# Altium schematic sheet СОГЛАСОВАНИЕ.SchDoc
size A2; Organization: Altium Limited; Address1: L3, 12a Rodborough Rd; Address2: Frenchs Forest; Address3: NSW; Address4: Australia 2086
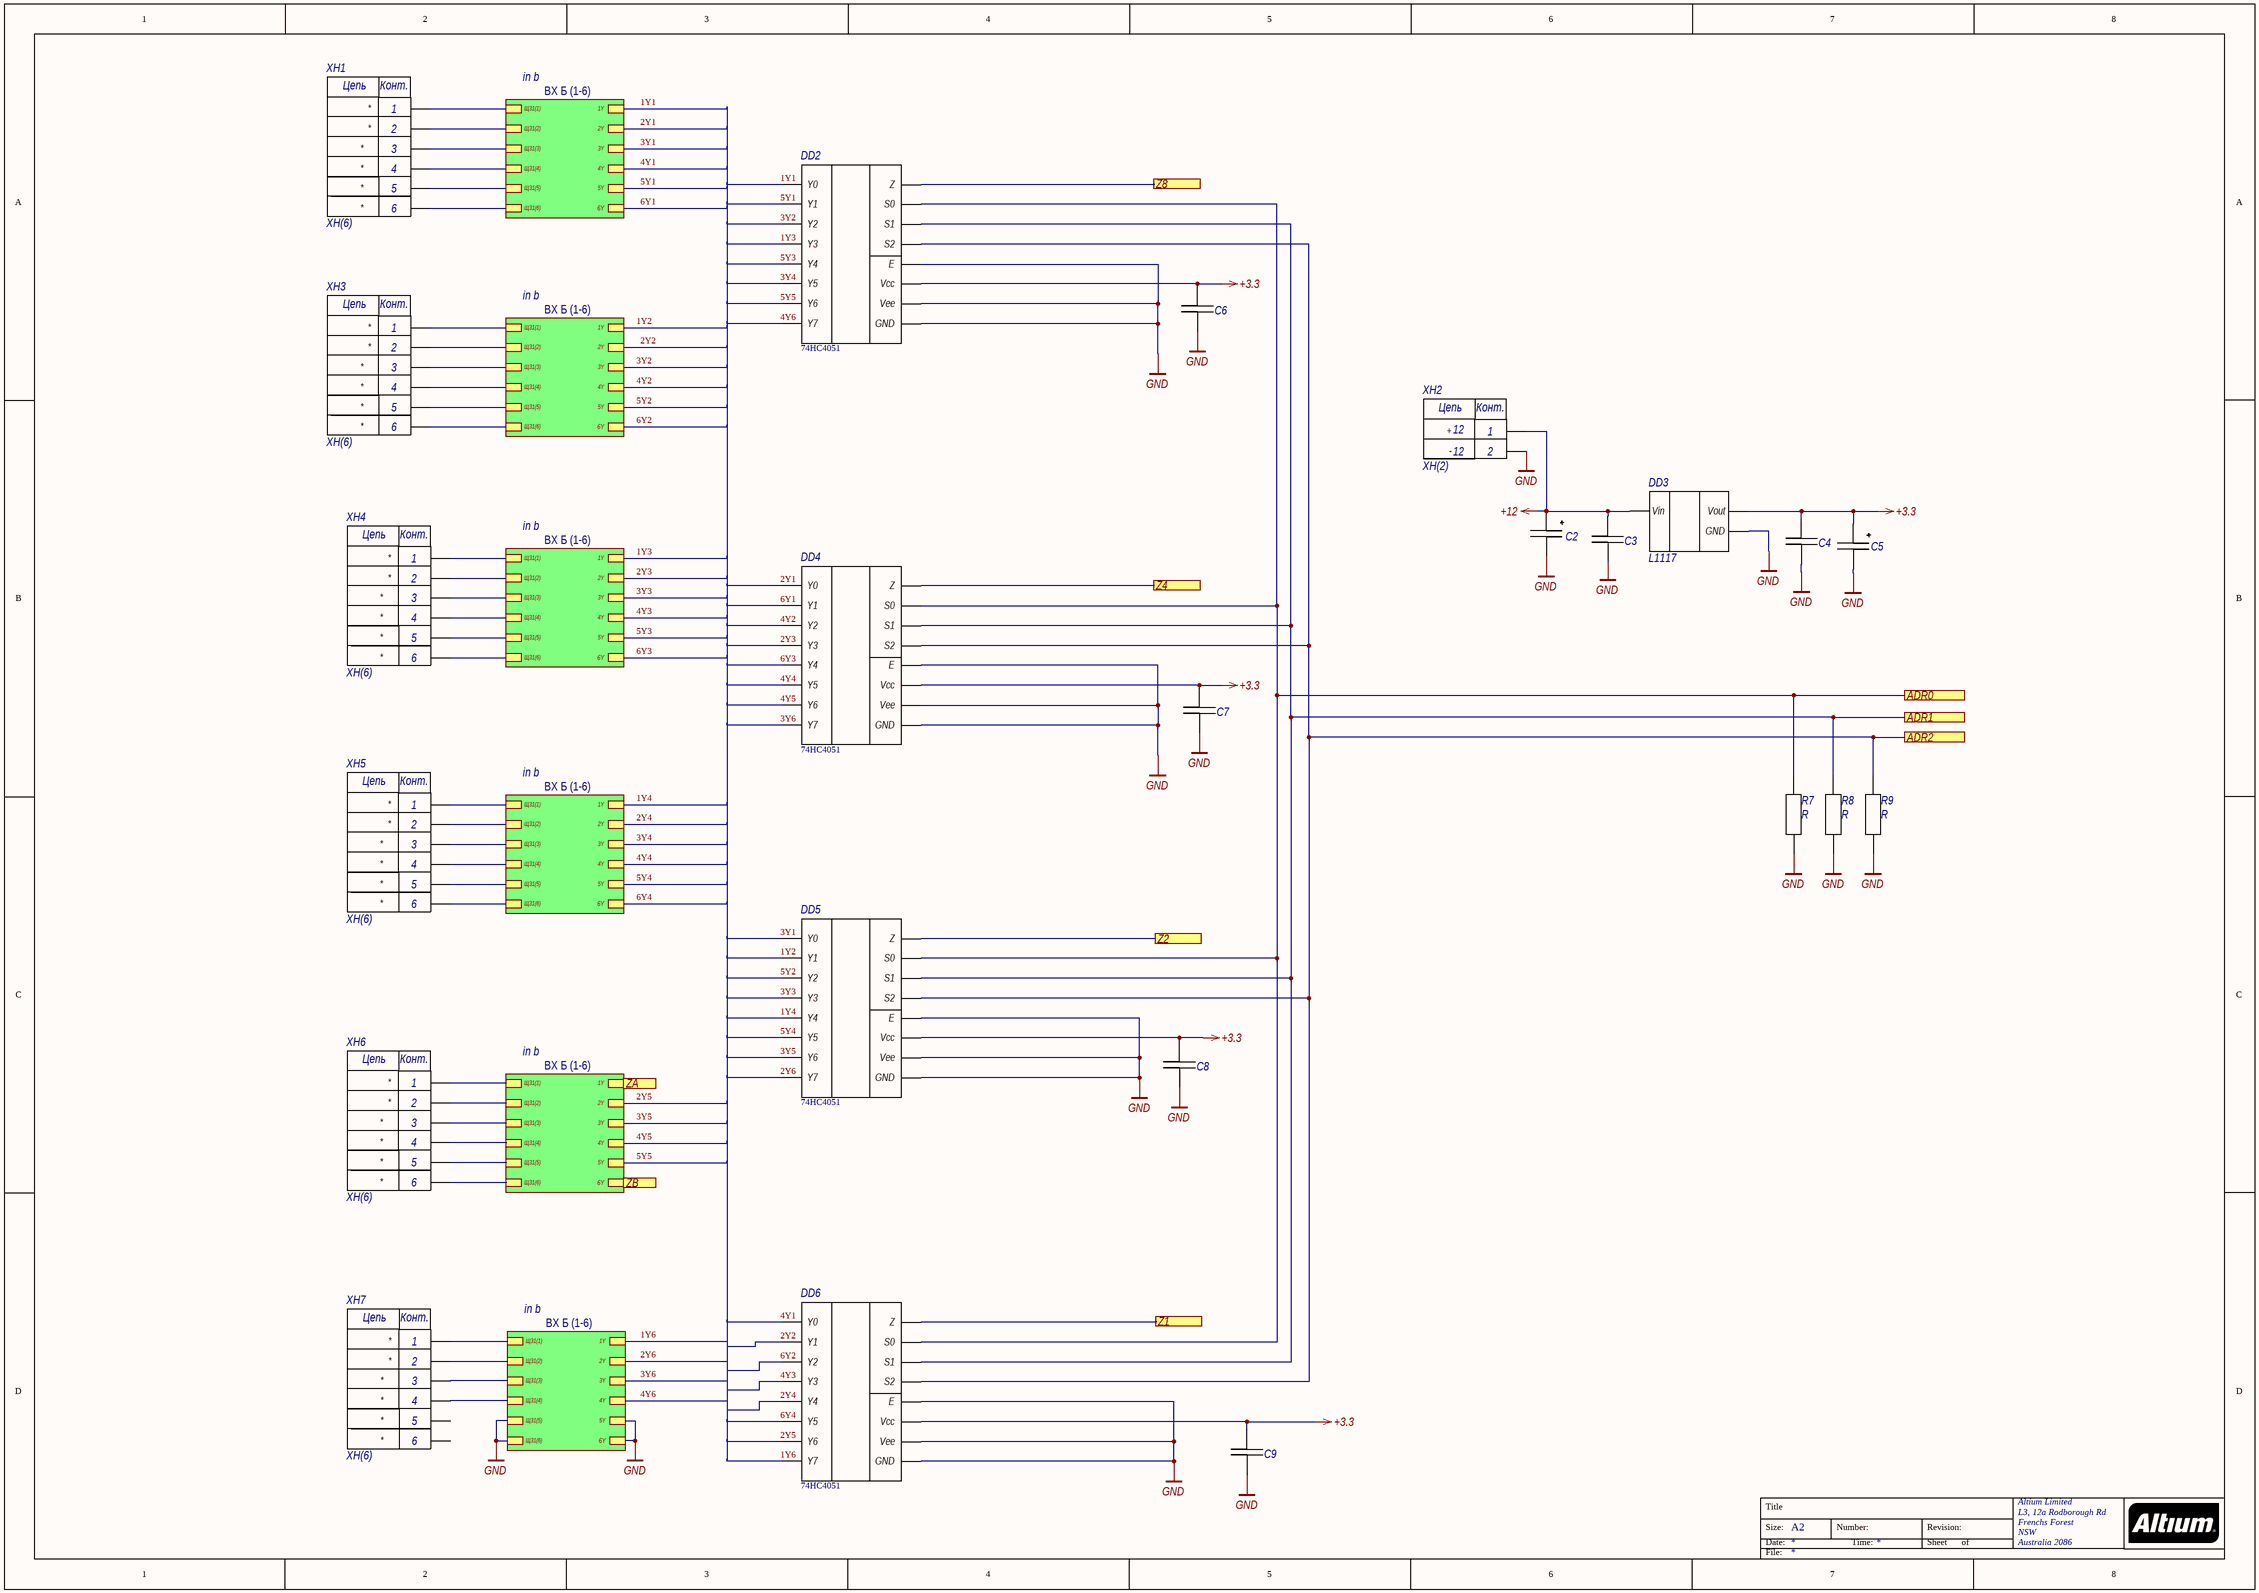
[diagram p0: СОГЛАСОВАНИЕ.SchDoc]

## Parts
C2  C(AlEL)  [C(AlEL)]  (value not drawn)
C3  C(ceramic)  [C(ceramic)]  (value not drawn)
C4  C(ceramic)  [C(ceramic)]  (value not drawn)
C5  C(AlEL)  [C(AlEL)]  (value not drawn)
C6  C(ceramic)  [C(ceramic)]  (value not drawn)
C7  C(ceramic)  [C(ceramic)]  (value not drawn)
C8  C(ceramic)  [C(ceramic)]  (value not drawn)
C9  C(ceramic)  [C(ceramic)]  (value not drawn)
DD2  74HC4051  [74HC4050(51)]
DD3  L1117  [LDL1117]
DD4  74HC4051  [74HC4050(51)]
DD5  74HC4051  [74HC4050(51)]
DD6  74HC4051  [74HC4050(51)]
R7  R  [R]
R8  R  [R]
R9  R  [R]
XH1  ХH(6)  [XH(6)]
XH2  ХН(2)  [ХН(2)]
XH3  ХH(6)  [XH(6)]
XH4  ХH(6)  [XH(6)]
XH5  ХH(6)  [XH(6)]
XH6  ХH(6)  [XH(6)]
XH7  ХH(6)  [XH(6)]

## Sub-sheets
in b = ВХ Б (1-6): 1Y, 2Y, 3Y, 4Y, Щ31(1), Щ31(2), Щ31(3), Щ31(4), 5Y, 6Y, Щ31(5), Щ31(6)
in b = ВХ Б (1-6): 1Y, 2Y, 3Y, 4Y, Щ31(1), Щ31(2), Щ31(3), Щ31(4), 5Y, 6Y, Щ31(5), Щ31(6)
in b = ВХ Б (1-6): 1Y, 2Y, 3Y, 4Y, Щ31(1), Щ31(2), Щ31(3), Щ31(4), 5Y, 6Y, Щ31(5), Щ31(6)
in b = ВХ Б (1-6): 1Y, 2Y, 3Y, 4Y, Щ31(1), Щ31(2), Щ31(3), Щ31(4), 5Y, 6Y, Щ31(5), Щ31(6)
in b = ВХ Б (1-6): 1Y, 2Y, 3Y, 4Y, Щ31(1), Щ31(2), Щ31(3), Щ31(4), 5Y, 6Y, Щ31(5), Щ31(6)
in b = ВХ Б (1-6): 1Y, 2Y, 3Y, 4Y, Щ31(1), Щ31(2), Щ31(3), Щ31(4), 5Y, 6Y, Щ31(5), Щ31(6)

## Ports
ADR0, ADR1, ADR2, Z1, Z2, Z4, Z8, ZA, ZB

## Nets
+3.3: C4.2 C5.1 C6.2 C7.2 C8.2 C9.2 DD2.16(Vcc) DD3.2(Vout) DD4.16(Vcc) DD5.16(Vcc) DD6.16(Vcc)
+12: C2.1 C3.2 DD3.3(Vin) XH2.1(+)
GND: C2.2 C3.1 C4.1 C5.2 C6.1 C7.1 C8.1 C9.1 DD2.6(E) DD2.7(Vee) DD2.8(GND) DD3.1(GND) DD4.6(E) DD4.7(Vee) DD4.8(GND) DD5.6(E) DD5.7(Vee) DD5.8(GND) DD6.6(E) DD6.7(Vee) DD6.8(GND) R7.1 R8.1 R9.1 XH2.2(-) ; sheet in b/5Y, sheet in b/6Y, sheet in b/Щ31(5), sheet in b/Щ31(6)
1Y1: DD2.13(Y0) ; sheet in b/1Y
1Y2: DD5.14(Y1) ; sheet in b/1Y
1Y3: DD2.12(Y3) ; sheet in b/1Y
1Y4: DD5.1(Y4) ; sheet in b/1Y
1Y6: DD6.4(Y7) ; sheet in b/1Y
2Y1: DD4.13(Y0) ; sheet in b/2Y
2Y2: DD6.14(Y1) ; sheet in b/2Y
2Y3: DD4.12(Y3) ; sheet in b/2Y
2Y4: DD6.1(Y4) ; sheet in b/2Y
2Y5: DD6.2(Y6) ; sheet in b/2Y
2Y6: DD5.4(Y7) ; sheet in b/2Y
3Y1: DD5.13(Y0) ; sheet in b/3Y
3Y2: DD2.15(Y2) ; sheet in b/3Y
3Y3: DD5.12(Y3) ; sheet in b/3Y
3Y4: DD2.5(Y5) ; sheet in b/3Y
3Y5: DD5.2(Y6) ; sheet in b/3Y
3Y6: DD4.4(Y7) ; sheet in b/3Y
4Y1: DD6.13(Y0) ; sheet in b/4Y
4Y2: DD4.15(Y2) ; sheet in b/4Y
4Y3: DD6.12(Y3) ; sheet in b/4Y
4Y4: DD4.5(Y5) ; sheet in b/4Y
4Y5: DD4.2(Y6) ; sheet in b/4Y
4Y6: DD2.4(Y7) ; sheet in b/4Y
5Y1: DD2.14(Y1) ; sheet in b/5Y
5Y2: DD5.15(Y2) ; sheet in b/5Y
5Y3: DD2.1(Y4) ; sheet in b/5Y
5Y4: DD5.5(Y5) ; sheet in b/5Y
5Y5: DD2.2(Y6) ; sheet in b/5Y
6Y1: DD4.14(Y1) ; sheet in b/6Y
6Y2: DD6.15(Y2) ; sheet in b/6Y
6Y3: DD4.1(Y4) ; sheet in b/6Y
6Y4: DD6.5(Y5) ; sheet in b/6Y
ADR0: DD2.11(S0) DD4.11(S0) DD5.11(S0) DD6.11(S0) R7.2 ; port ADR0
ADR1: DD2.10(S1) DD4.10(S1) DD5.10(S1) DD6.10(S1) R8.2 ; port ADR1
ADR2: DD2.9(S2) DD4.9(S2) DD5.9(S2) DD6.9(S2) R9.2 ; port ADR2
Z1: DD6.3(Z) ; port Z1
Z2: DD5.3(Z) ; port Z2
Z4: DD4.3(Z) ; port Z4
Z8: DD2.3(Z) ; port Z8
ZA: port ZA, sheet in b/1Y
ZB: port ZB, sheet in b/6Y
NetXH1_1: XH1.1 ; sheet in b/Щ31(1)
NetXH1_2: XH1.2 ; sheet in b/Щ31(2)
NetXH1_3: XH1.3 ; sheet in b/Щ31(3)
NetXH1_4: XH1.4 ; sheet in b/Щ31(4)
NetXH1_5: XH1.5 ; sheet in b/Щ31(5)
NetXH1_6: XH1.6 ; sheet in b/Щ31(6)
NetXH3_1: XH3.1 ; sheet in b/Щ31(1)
NetXH3_2: XH3.2 ; sheet in b/Щ31(2)
NetXH3_3: XH3.3 ; sheet in b/Щ31(3)
NetXH3_4: XH3.4 ; sheet in b/Щ31(4)
NetXH3_5: XH3.5 ; sheet in b/Щ31(5)
NetXH3_6: XH3.6 ; sheet in b/Щ31(6)
NetXH4_1: XH4.1 ; sheet in b/Щ31(1)
NetXH4_2: XH4.2 ; sheet in b/Щ31(2)
NetXH4_3: XH4.3 ; sheet in b/Щ31(3)
NetXH4_4: XH4.4 ; sheet in b/Щ31(4)
NetXH4_5: XH4.5 ; sheet in b/Щ31(5)
NetXH4_6: XH4.6 ; sheet in b/Щ31(6)
NetXH5_1: XH5.1 ; sheet in b/Щ31(1)
NetXH5_2: XH5.2 ; sheet in b/Щ31(2)
NetXH5_3: XH5.3 ; sheet in b/Щ31(3)
NetXH5_4: XH5.4 ; sheet in b/Щ31(4)
NetXH5_5: XH5.5 ; sheet in b/Щ31(5)
NetXH5_6: XH5.6 ; sheet in b/Щ31(6)
NetXH6_1: XH6.1 ; sheet in b/Щ31(1)
NetXH6_2: XH6.2 ; sheet in b/Щ31(2)
NetXH6_3: XH6.3 ; sheet in b/Щ31(3)
NetXH6_4: XH6.4 ; sheet in b/Щ31(4)
NetXH6_5: XH6.5 ; sheet in b/Щ31(5)
NetXH6_6: XH6.6 ; sheet in b/Щ31(6)
NetXH7_1: XH7.1 ; sheet in b/Щ31(1)
NetXH7_2: XH7.2 ; sheet in b/Щ31(2)
NetXH7_3: XH7.3 ; sheet in b/Щ31(3)
NetXH7_4: XH7.4 ; sheet in b/Щ31(4)

Not connected (* = marked no-connect by the designer): XH7 5(*) 6(*)

## Notes on the sheet
- 12
- Title
- Size:
- Date:
- File:
- A2
- Number:
- Time:
- Revision:
- Sheet
- of
- (in symbol ХH(6)) Цепь; Конт.
- (in symbol ХН(2)) Цепь; Конт.

## Library data of the parts
DD3 = LDL1117